# Altium schematic sheet PAGE7 - BANK3,4,5 I_0.SchDoc
size 386 x 246 mm
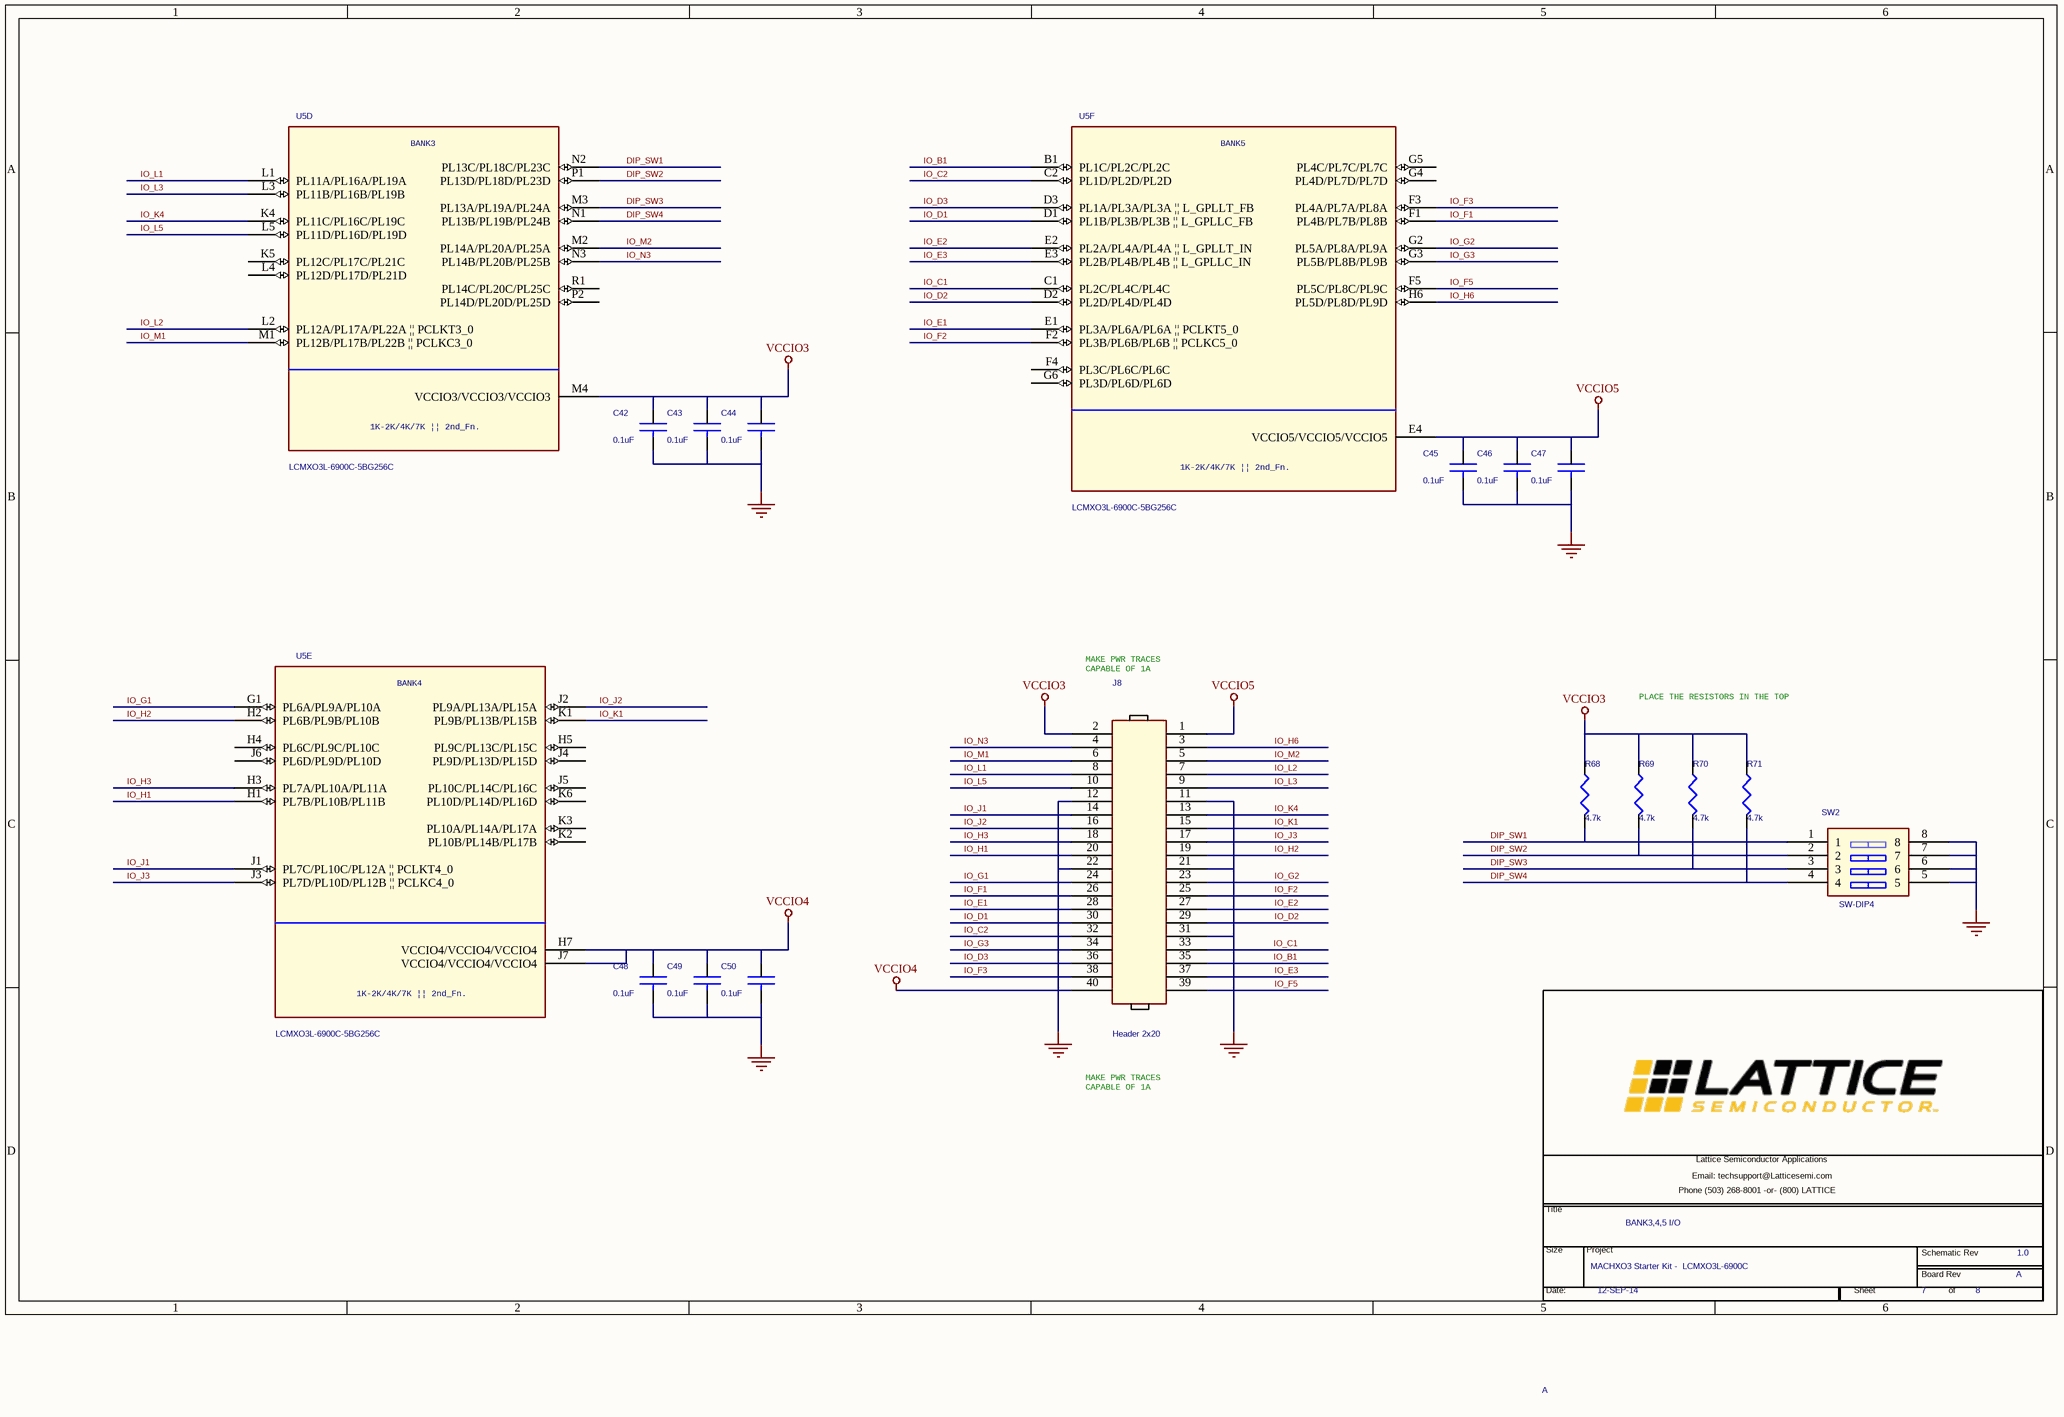
[diagram p0: PAGE7 - BANK3,4,5 I_0.SchDoc]

## Parts
*  Project Name: MACHXO3 Starter Kit -  LCMXO3L-6900C  Title: BANK3,4,5 I/O  Page Number: 7  Page Count: 8  RevCode: 1.0  Page Size: A  Date:: 12-SEP-14  (hidden comment: Lattice Title Block New Brand)  (graphical)
C42  0.1uF  [cc0402]
C43  0.1uF  [cc0402]
C44  0.1uF  [cc0402]
C45  0.1uF  [cc0402]
C46  0.1uF  [cc0402]
C47  0.1uF  [cc0402]
C48  0.1uF  [cc0402]
C49  0.1uF  [cc0402]
C50  0.1uF  [cc0402]
J8  Header 2x20  [hdr_samtec_mtsw_2x20_100]
R68  4.7k  [cr0402]
R69  4.7k  [cr0402]
R70  4.7k  [cr0402]
R71  4.7k  [cr0402]
SW2  SW-DIP4  [sw_sp_st_cts_195-4mst]
U5  LCMXO3L-6900C-5BG256C  [bga256_0p8_14p0]  (parts D,E,F of 7)

## Nets
GND: C42.2 C43.2 C44.2 C45.2 C46.2 C47.2 C48.2 C49.2 C50.2 J8.11 J8.12 J8.21 J8.22 J8.31 SW2.5 SW2.6 SW2.7 SW2.8
VCCIO3: C42.1 C43.1 C44.1 J8.2 R68.1 R69.1 R70.1 R71.1 U5.M4(VCCIO3/VCCIO3/VCCIO3)
VCCIO4: C48.1 C49.1 C50.1 J8.40 U5.H7(VCCIO4/VCCIO4/VCCIO4) U5.J7(VCCIO4/VCCIO4/VCCIO4)
VCCIO5: C45.1 C46.1 C47.1 J8.1 U5.E4(VCCIO5/VCCIO5/VCCIO5)
DIP_SW1: R68.2 SW2.1 U5.N2(PL13C/PL18C/PL23C)
DIP_SW2: R69.2 SW2.2 U5.P1(PL13D/PL18D/PL23D)
DIP_SW3: R70.2 SW2.3 U5.M3(PL13A/PL19A/PL24A)
DIP_SW4: R71.2 SW2.4 U5.N1(PL13B/PL19B/PL24B)
IO_B1: J8.35 U5.B1(PL1C/PL2C/PL2C)
IO_C1: J8.33 U5.C1(PL2C/PL4C/PL4C)
IO_C2: J8.32 U5.C2(PL1D/PL2D/PL2D)
IO_D1: J8.30 U5.D1(PL1B/PL3B/PL3B_||_L_GPLLC_FB)
IO_D2: J8.29 U5.D2(PL2D/PL4D/PL4D)
IO_D3: J8.36 U5.D3(PL1A/PL3A/PL3A_||_L_GPLLT_FB)
IO_E1: J8.28 U5.E1(PL3A/PL6A/PL6A_||_PCLKT5_0)
IO_E2: J8.27 U5.E2(PL2A/PL4A/PL4A_||_L_GPLLT_IN)
IO_E3: J8.37 U5.E3(PL2B/PL4B/PL4B_||_L_GPLLC_IN)
IO_F1: J8.26 U5.F1(PL4B/PL7B/PL8B)
IO_F2: J8.25 U5.F2(PL3B/PL6B/PL6B_||_PCLKC5_0)
IO_F3: J8.38 U5.F3(PL4A/PL7A/PL8A)
IO_F5: J8.39 U5.F5(PL5C/PL8C/PL9C)
IO_G1: J8.24 U5.G1(PL6A/PL9A/PL10A)
IO_G2: J8.23 U5.G2(PL5A/PL8A/PL9A)
IO_G3: J8.34 U5.G3(PL5B/PL8B/PL9B)
IO_H1: J8.20 U5.H1(PL7B/PL10B/PL11B)
IO_H2: J8.19 U5.H2(PL6B/PL9B/PL10B)
IO_H3: J8.18 U5.H3(PL7A/PL10A/PL11A)
IO_H6: J8.3 U5.H6(PL5D/PL8D/PL9D)
IO_J1: J8.14 U5.J1(PL7C/PL10C/PL12A_||_PCLKT4_0)
IO_J2: J8.16 U5.J2(PL9A/PL13A/PL15A)
IO_J3: J8.17 U5.J3(PL7D/PL10D/PL12B_||_PCLKC4_0)
IO_K1: J8.15 U5.K1(PL9B/PL13B/PL15B)
IO_K4: J8.13 U5.K4(PL11C/PL16C/PL19C)
IO_L1: J8.8 U5.L1(PL11A/PL16A/PL19A)
IO_L2: J8.7 U5.L2(PL12A/PL17A/PL22A_||_PCLKT3_0)
IO_L3: J8.9 U5.L3(PL11B/PL16B/PL19B)
IO_L5: J8.10 U5.L5(PL11D/PL16D/PL19D)
IO_M1: J8.6 U5.M1(PL12B/PL17B/PL22B_||_PCLKC3_0)
IO_M2: J8.5 U5.M2(PL14A/PL20A/PL25A)
IO_N3: J8.4 U5.N3(PL14B/PL20B/PL25B)

Not connected (* = marked no-connect by the designer): U5 F4(PL3C/PL6C/PL6C) G4(PL4D/PL7D/PL7D) G5(PL4C/PL7C/PL7C) G6(PL3D/PL6D/PL6D) H4(PL6C/PL9C/PL10C) H5(PL9C/PL13C/PL15C) J4(PL9D/PL13D/PL15D) J5(PL10C/PL14C/PL16C) J6(PL6D/PL9D/PL10D) K2(PL10B/PL14B/PL17B) K3(PL10A/PL14A/PL17A) K5(PL12C/PL17C/PL21C) K6(PL10D/PL14D/PL16D) L4(PL12D/PL17D/PL21D) P2(PL14D/PL20D/PL25D) R1(PL14C/PL20C/PL25C)

## Notes on the sheet
- MAKE PWR TRACES
  CAPABLE OF 1A
- PLACE THE RESISTORS IN THE TOP
- (in symbol Lattice Title Block New Brand) Lattice Semiconductor Applications; Email: techsupport@Latticesemi.com; Phone (503) 268-8001 -or- (800) LATTICE; Title; Size; Project; Schematic Rev; Board Rev; Date:; Sheet; of
- (in symbol LCMXO3L-1K/2K/4K/7K-BG256, part D) BANK3; 1K-2K/4K/7K || 2nd_Fn.
- (in symbol LCMXO3L-1K/2K/4K/7K-BG256, part E) BANK4; 1K-2K/4K/7K || 2nd_Fn.
- (in symbol LCMXO3L-1K/2K/4K/7K-BG256, part F) BANK5; 1K-2K/4K/7K || 2nd_Fn.

## Library data of the parts
C42-C50 = 0u1_0402: CAP CER 0.1UF 16V 10% X7R 0402; Manufacturer Part Number: C0402C104K4RACTU; Manufacturer: Kemet; Class: Discrete; Digikey P/N: 399-3521-2-ND
J8 = HEADER 20X2: CONN HEADER 40POS .100" DL GOLD; Manufacturer: Samtec; Manufacturer Part Number: TSW-120-07-G-D; ASSY: DNI; Digikey P/N: SAM1028-20-ND
R68-R71 = 5k1_0402: RES 4.70K OHM 1/10W 1% 0603 SMD; Manufacturer: Vishay; Manufacturer Part Number: CRCW06034K70FKEA; Class: Discrete; Digikey P/N: 541-4.70KHTR-ND
SW2 = DIP-SW: SWITCH SIDE ACTUATED 4 SEC 50V; Manufacturer Part Number: 195-4MST; Manufacturer: CTS Electrocomponents; Digikey P/N: CT1954MST-ND
U5 = LCMXO3L-1K/2K/4K/7K-BG256: IC FPGA 6864LUTS 256BGA; Manufacturer: Lattice semi; Source Part: LCMXO3L-1K/2K/4K/7K-BG256A.Normal; SPLIT_INST: TRUE; SWAP_INFO: (S1+S2+S3+S4+S5+S6+S7); Name: I16790692; Primitive: DEFAULT; Implementation Type: <none>; Location X-Coordinate: 0; Source Library: D:\DESIGN_DOC\XO3\LATTICEORCADCAPTURESCHEMATICLIBRARYOLB\LATTICEORCADCAPTURESCHEMATICLIBRARYOLB\LATTICE_SYM\LATTICEPLDS.OLB; Power Pins Visible: False; Digikey P/N: 220-1886-ND; Location Y-Coordinate: 0; Color: Default; Source Package: LCMXO3L-1K/2K/4K/7K-BG256; Graphic: LCMXO3L-1K/2K/4K/7K-BG256A.Normal; Manufacturer Part Number: LCMXO3L-6900C-5BG256C
* = Lattice Title Block New Brand: Board Rev: A